# EAGLE design aepro_27C512 (EAGLE 9.4.2)
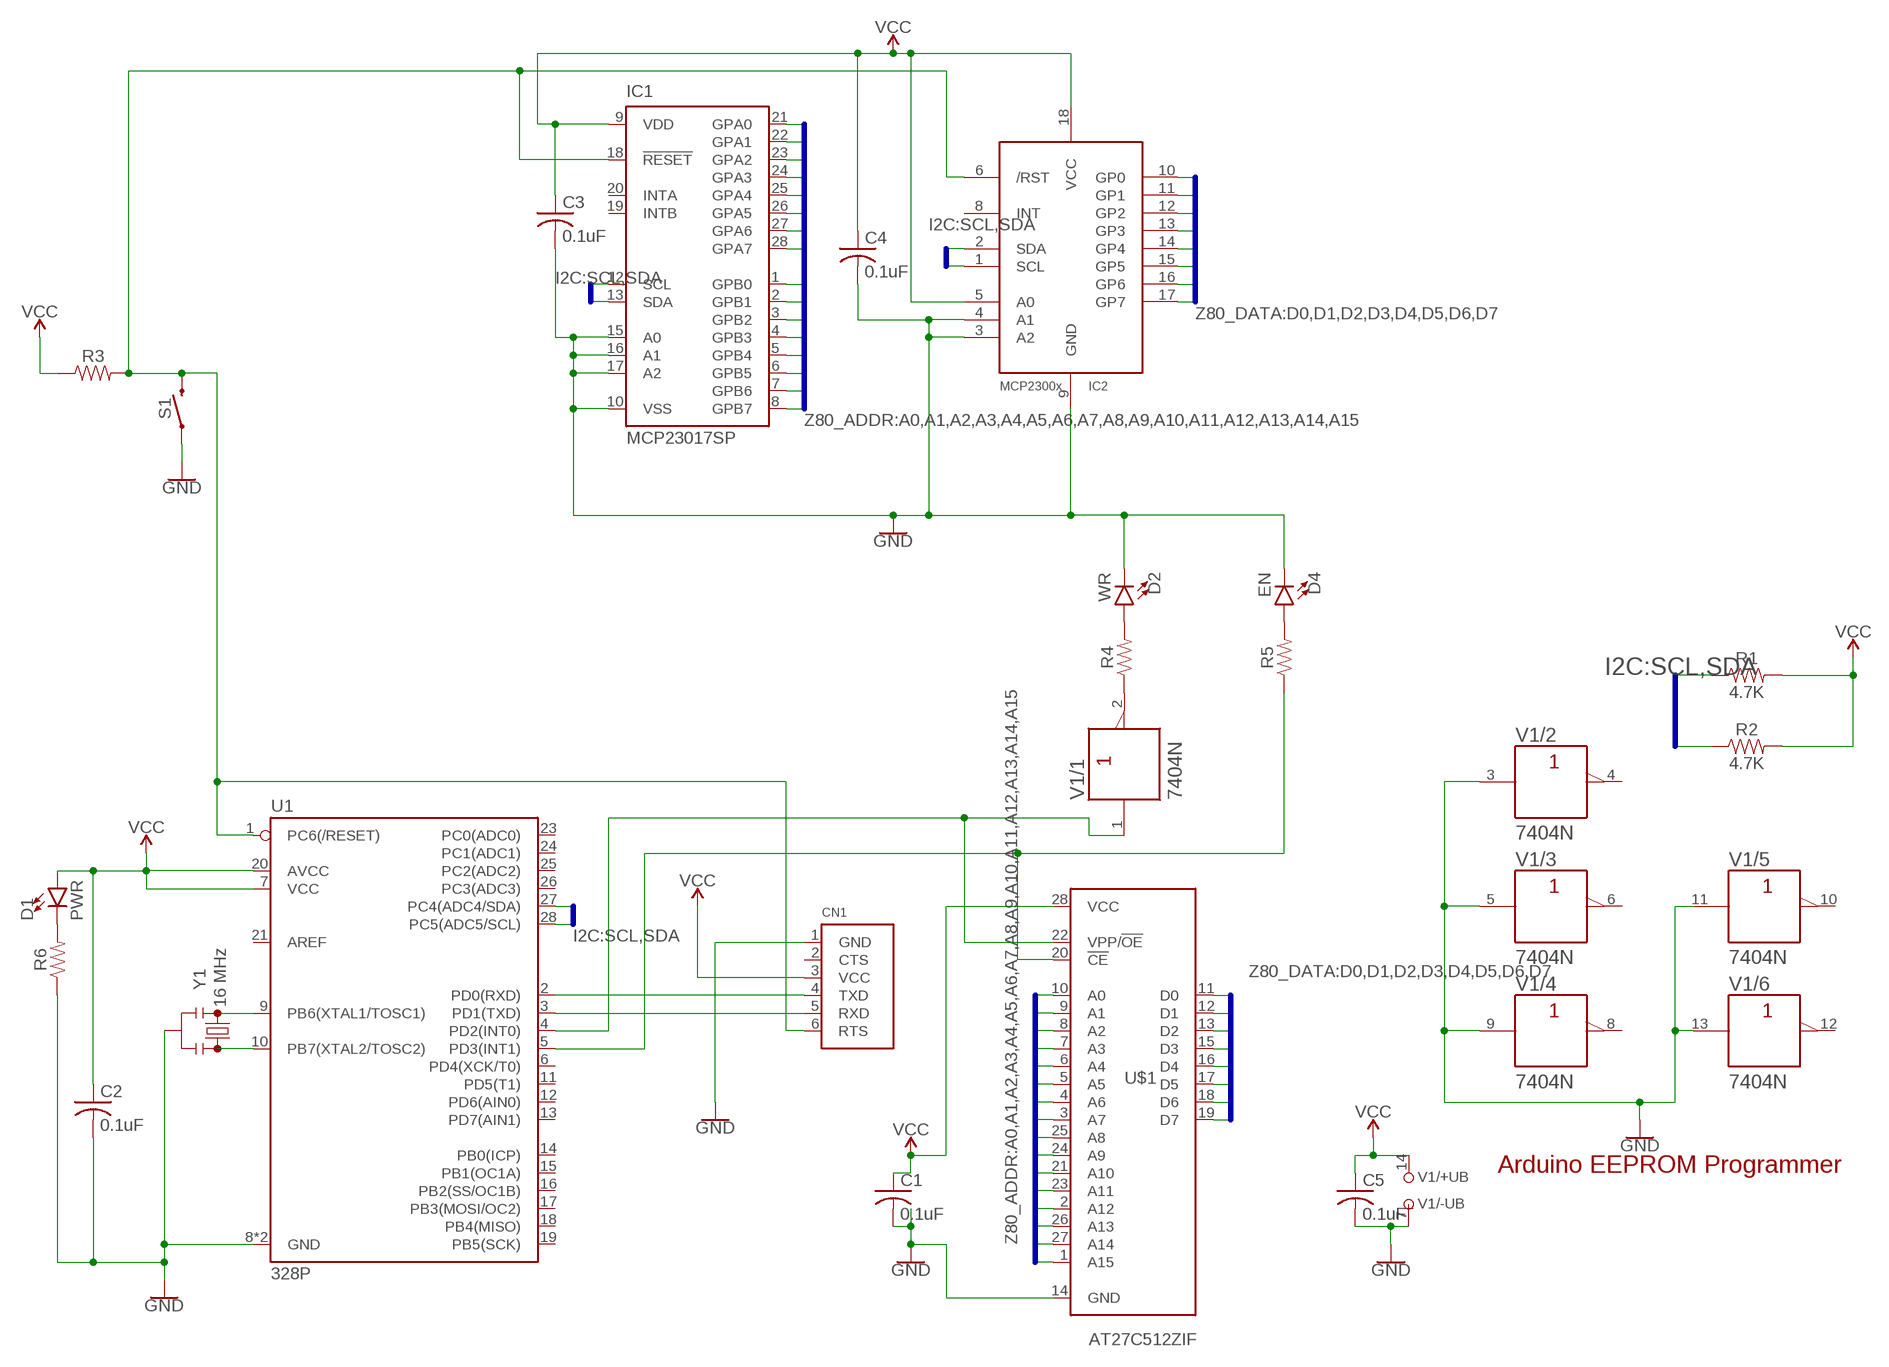
[diagram p0: schematic, sheet 1]

## Parts
C1  0.1uF  C-US050-024X044  [C050-024X044]
C2  0.1uF  C-US050-024X044  [C050-024X044]
C3  0.1uF  C-US050-024X044  [C050-024X044]
C4  0.1uF  C-US050-024X044  [C050-024X044]
C5  0.1uF  C-US050-024X044  [C050-024X044]
CN1  FTDIUSBCABLE  [1X06_ROUND]
D1  PWR  LED3MM  [LED_3MM]
D2  WR  LED3MM  [LED_3MM]
D4  EN  LED3MM  [LED_3MM]
IC1  MCP23017SP  [DIL28-3]
IC2  MCP23008/P  [DIL18]
R1  4.7K  RESISTORAXIAL-0.3  [AXIAL-0.3]
R2  4.7K  RESISTORAXIAL-0.3  [AXIAL-0.3]
R3  RESISTORAXIAL-0.3  [AXIAL-0.3]
R4  RESISTORAXIAL-0.3  [AXIAL-0.3]
R5  RESISTORAXIAL-0.3  [AXIAL-0.3]
R6  RESISTORAXIAL-0.3  [AXIAL-0.3]
S1  MOMENTARY-SWITCH-SPST-PTH-6.0MM  [TACTILE_SWITCH_PTH_6.0MM]
U1  328P  ATMEGA328P_PDIP  [DIP28]
U$1  AT27C512ZIF  [DIL28-6-ZIF_SOCKET]
V1  7404N  [DIL14]
Y1  16 MHz  RESONATORPTH-7.6X3.8  [RESONATOR-PTH-7.6X3.8]

## Nets
A0: IC1.21(GPA0) U$1.10(A0)
A1: IC1.22(GPA1) U$1.9(A1)
A2: IC1.23(GPA2) U$1.8(A2)
A3: IC1.24(GPA3) U$1.7(A3)
A4: IC1.25(GPA4) U$1.6(A4)
A5: IC1.26(GPA5) U$1.5(A5)
A6: IC1.27(GPA6) U$1.4(A6)
A7: IC1.28(GPA7) U$1.3(A7)
A8: IC1.1(GPB0) U$1.25(A8)
A9: IC1.2(GPB1) U$1.24(A9)
A10: IC1.3(GPB2) U$1.21(A10)
A11: IC1.4(GPB3) U$1.23(A11)
A12: IC1.5(GPB4) U$1.2(A12)
A13: IC1.6(GPB5) U$1.26(A13)
A14: IC1.7(GPB6) U$1.27(A14)
A15: IC1.8(GPB7) U$1.1(A15)
D0: IC2.10(GP0) U$1.11(D0)
D1: IC2.11(GP1) U$1.12(D1)
D2: IC2.12(GP2) U$1.13(D2)
D3: IC2.13(GP3) U$1.15(D3)
D4: IC2.14(GP4) U$1.16(D4)
D5: IC2.15(GP5) U$1.17(D5)
D6: IC2.16(GP6) U$1.18(D6)
D7: IC2.17(GP7) U$1.19(D7)
GND: C1.2 C2.2 C3.2 C4.2 C5.2 CN1.1(GND) D2.K(C) D4.K(C) IC1.10(VSS) IC1.15(A0) IC1.16(A1) IC1.17(A2) IC2.3(A2) IC2.4(A1) IC2.9(GND) R6.P$1 S1.1 U1.8(GND) U1.22(GND) U$1.14(GND) V1.3(/2:A) V1.5(/3:A) V1.7(/-UB:-UB) V1.9(/4:A) V1.11(/5:A) V1.13(/6:A) Y1.2
N$1: D2.A R4.P$2
N$2: U1.4(PD2(INT0)) U$1.22(VPP/!OE) V1.1(/1:A)
N$4: R5.P$1 U1.5(PD3(INT1)) U$1.20(!CE)
N$6: CN1.4(TXD) U1.2(PD0(RXD))
N$7: CN1.6(RTS) IC1.18(!RESET) IC2.6(/RST) R3.P$2 S1.3 U1.1(PC6(/RESET))
N$8: R4.P$1 V1.2(/1:Y)
N$9: D4.A R5.P$2
N$10: D1.K(C) R6.P$2
N$11: CN1.5(RXD) U1.3(PD1(TXD))
N$13: U1.9(PB6(XTAL1/TOSC1)) Y1.1
N$14: U1.10(PB7(XTAL2/TOSC2)) Y1.3
SCL: IC1.12(SCL) IC2.1(SCL) R1.P$1 U1.28(PC5(ADC5/SCL))
SDA: IC1.13(SDA) IC2.2(SDA) R2.P$1 U1.27(PC4(ADC4/SDA))
VCC: C1.1 C2.1 C3.1 C4.1 C5.1 CN1.3(VCC) D1.A IC1.9(VDD) IC2.5(A0) IC2.18(VCC) R1.P$2 R2.P$2 R3.P$1 U1.7(VCC) U1.20(AVCC) U$1.28(VCC) V1.14(/+UB:+UB)
Unconnected: CN1.2(CTS) IC1.19(INTB) IC1.20(INTA) IC2.8(INT) U1.6(PD4(XCK/T0)) U1.11(PD5(T1)) U1.12(PD6(AIN0)) U1.13(PD7(AIN1)) U1.14(PB0(ICP)) U1.15(PB1(OC1A)) U1.16(PB2(SS/OC1B)) U1.17(PB3(MOSI/OC2)) U1.18(PB4(MISO)) U1.19(PB5(SCK)) U1.21(AREF) U1.23(PC0(ADC0)) U1.24(PC1(ADC1)) U1.25(PC2(ADC2)) U1.26(PC3(ADC3)) V1.4(/2:Y) V1.6(/3:Y) V1.8(/4:Y) V1.10(/5:Y) V1.12(/6:Y)

## Buses
I2C:SCL,SDA
Z80_ADDR:A0,A1,A2,A3,A4,A5,A6,A7,A8,A9,A10,A11,A12,A13,A14,A15
Z80_DATA:D0,D1,D2,D3,D4,D5,D6,D7

## Notes on the sheet
- Arduino EEPROM Programmer

## Library data of the parts
C1-C5 = rcl:C-US: CAPACITOR, American symbol; SPICEPREFIX: C
CN1 = microbuilder:FTDIUSBCABLE: FTDI TTL-232R USB Cable Connector for FTDI's USB->RS232 Cable
D1 D2 D4 = SparkFun-LED:LED: LED (Generic) Standard schematic elements and footprints for 5mm, 3mm, 1206, and 0603 sized LEDs. Generic LEDs with no color specified.; PROD_ID: DIO-08794
IC1 = adafruit:MCP23017: http://ww1.microchip.com/downloads/en/DeviceDoc/21952a.pdf Source: http://ww1.microchip.com/downloads/en/DeviceDoc/21952a.pdf
IC2 = adafruit:MCP23008: MCP23008 Inexpensive i2c i/o expander - 8 general purpose i/o pins with optional pullups
R1-R6 = SparkFun-Resistors:RESISTOR: Generic Resistor Package
S1 = SparkFun-Switches:MOMENTARY-SWITCH-SPST: Momentary Switch (Pushbutton) - SPST Normally-open (NO) SPST momentary switches (buttons, pushbuttons). Variants PTH-12MM - 12mm square, through-hole Momentary Pushbutton Switch - 12mm Square <https://www.sparkfun.com/products/9190> (COM-09190) PTH-6.0MM, PTH-6.0MM-KIT - 6.0mm square, through-hole Mini Pushbutton Switch <https://www.sparkfun.com/products/97> (COM-00097) KIT package intended for soldering kit's - only one side of pads' copper is exposed. PTH-RIGHT-ANGLE-KIT - Right-angle, through-hole Right Angle Tactile Button <https://www.sparkfun.com/products/10791> - Used on SparkFun BigTime Watch Kit <https://www.sparkfun.com/products/11734> SMD-12MM - 12mm square, surface-mount Tactile Button - SMD (12mm) <https://www.sparkfun.com/products/12993> (COM-12993) Used on SparkFun PicoBoard <https://www.sparkfun.com/products/11888> SMD-4.5MM - 4.5mm Square Trackball Switch Used on SparkFun Blackberry Trackballer Breakout <https://www.sparkfun.com/products/13169> SMD-4.6MMX2.8MM - 4.60mm x 2.80mm, surface mount Used on SparkFun SAMD21 Mini Breakout <https://www.sparkfun.com/products/13664> SMD-5.2MM, SMD-5.2-REDUNDANT - 5.2mm square, surface-mount Mini Pushbutton Switch - SMD <https://www.sparkfun.com/products/8720> (COM-08720) Used on Arduino Pro Mini <https://www.sparkfun.com/products/11114> REDUNDANT package connects both switch circuits together SMD-6.0X3.5MM - 6.0 x 3.5mm, surface mount Momentary Reset Switch SMD <https://www.sparkfun.com/products/8229> (COM-08229) SMD-6.2MM-TALL - 6.2mm square, surface mount Tactile Button - SMD (6mm) <https://www.sparkfun.com/products/12992> Used on SparkFun Digital Sandbox <https://www.sparkfun.com/products/12651> SMD-RIGHT-ANGLE - Right-angle, surface mount Used on SparkFun Block for Intel® Edison - Arduino <https://www.sparkfun.com/products/13036>; PROD_ID: SWCH-08441; SF_SKU: COM-00097
U1 = SparkFun-IC-Microcontroller:ATMEGA328P_PDIP: Atmel 328P Through hole ATMEGA328P uC used in the Arduino 32kb flash, 1k EEPROM, 2k SRAM Datasheet <http://www.sparkfun.com/datasheets/Components/SMD/ATMega328.pdf> SparkFun Products Storefront component: AVR 28 Pin 20MHz 32K 6A/D - ATMega328P <https://www.sparkfun.com/products/9061> (COM-09061) SparkFun Simon Says - Through-Hole Soldering Kit <https://www.sparkfun.com/products/10547> (KIT-10547) SparkFun Learn to Solder - Simon Says <https://www.sparkfun.com/products/13708> (KIT-13708) SparkFun BigTime Watch Kit <https://www.sparkfun.com/products/11734> (KIT-11734) SparkFun ClockIt <https://www.sparkfun.com/products/10930> (KIT-10930) SparkFun Serial Enabled LCD Kit <https://www.sparkfun.com/products/10097> (LCD-10097) SparkFun Simon Tilts - Through Hole Soldering Kit <https://www.sparkfun.com/products/12634> (KIT-12634) SparkFun Frequency Counter Kit <https://www.sparkfun.com/products/10140> (KIT-10140) FabFM Radio Kit <https://www.sparkfun.com/products/11043> (KIT-11043) SparkFun Binary Blaster Kit <https://www.sparkfun.com/products/12037> (KIT-12037) SparkFun Metro-Gnome <https://www.sparkfun.com/products/9236> (KIT-09236) ATmega328 with Arduino Optiboot (Uno) <https://www.sparkfun.com/products/10524> (DEV-10524); PROD_ID: IC-09136
U$1 = wntrmute:AT27C512
V1 = 74ttl-din:74*04: Hex INVERTER
Y1 = SparkFun-Clocks:RESONATOR: Resonators (Generic) Ceramic resonators are clock-generating components, often used to control timing in microcontrollers. They usually have 3 pins: two pins for oscillation, and one pin for ground. Compared to crystals, resonators have worse tolerance, but are usually much cheaper. Plus, they have built-in load capacitors! These devices are used on boards like the Arduino Pro 8MHz <https://www.sparkfun.com/products/11114> and Arduino Pro 16MHz <https://www.sparkfun.com/products/11113>.

## Net classes
0 default: width 0.152 mm, drill 0.254 mm, clearance 0.152 mm

## Board
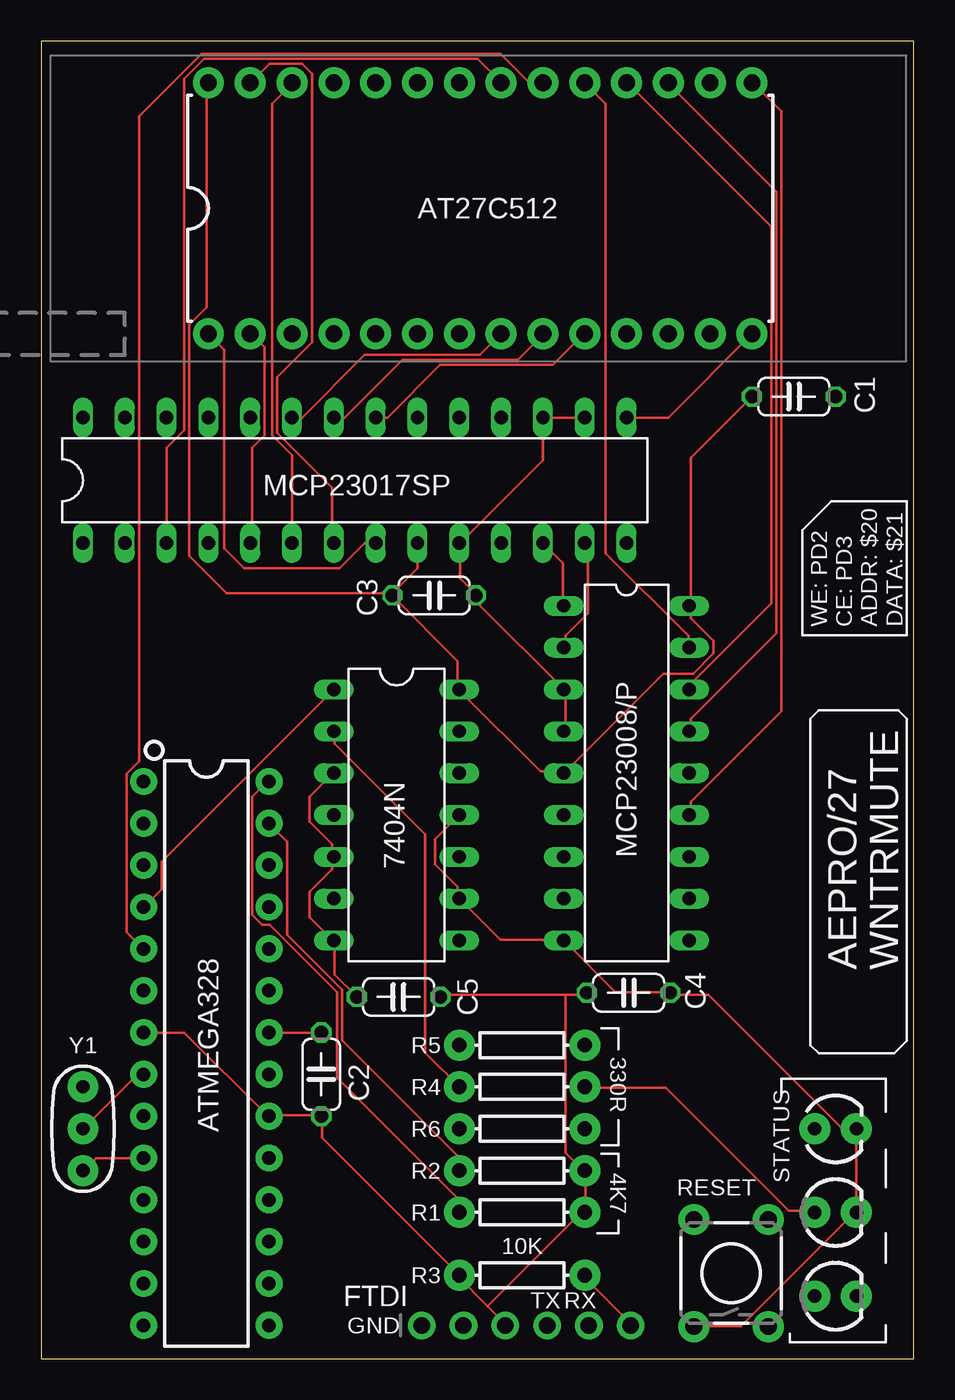
[diagram p1: board, top side]
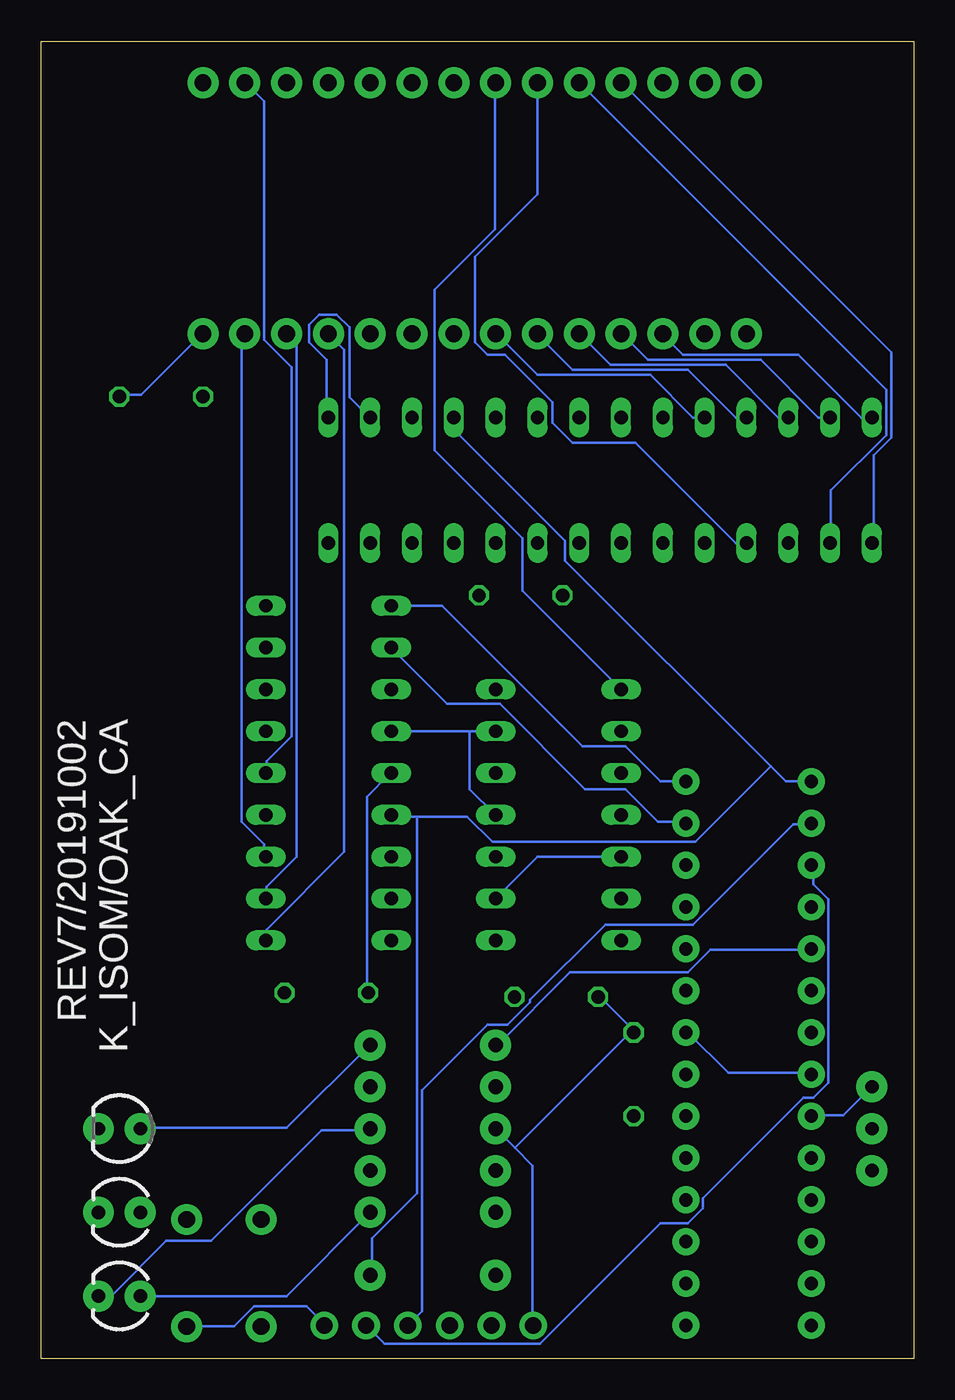
[diagram p2: board, bottom side, seen from below]

Size 53.01 x 80 mm. Coordinates in mm from the lower left corner, seen from the top.
Outline: 0,0 53.01,0 53.01,80 0,80 0,0
Copper layers (1*16): Top 0.035559375mm / dielectric 1.6mm / Bottom 0.035559375mm
Design rules "oshpark-2layer": minimum track width 6mil, minimum drill 10mil, track to track 6mil, track to pad 6mil, pad to pad 6mil, via to via 6mil, smd to smd 6mil, copper to edge 15mil, drill to drill 6mil, minimum pad ring 5mil, minimum via ring 5mil, stop-mask expansion 2.5mil, vias tented up to drill 0mil, thermal gap 10mil

### Footprints (pad centres in the part's own frame; a part is rotated, then mirrored left to right if it is on the bottom)
C050-024X044 = drill 0.813 octagon: 1 -2.54,0; 2 2.54,0
1X06_ROUND = drill 1 pad 1.676: 1 -6.35,0; 2 -3.81,0; 3 -1.27,0; 4 1.27,0; 5 3.81,0; 6 6.35,0
LED_3MM = drill 0.813 pad 1.88: A -1.27,0; K 1.27,0
DIL28-3 = drill 0.813 long: 1 -16.51,-3.81; 2 -13.97,-3.81; 3 -11.43,-3.81; 4 -8.89,-3.81; 5 -6.35,-3.81; 6 -3.81,-3.81; 7 -1.27,-3.81; 8 1.27,-3.81; 9 3.81,-3.81; 10 6.35,-3.81; 11 8.89,-3.81; 12 11.43,-3.81; 13 13.97,-3.81; 14 16.51,-3.81; 15 16.51,3.81; 16 13.97,3.81; 17 11.43,3.81; 18 8.89,3.81; 19 6.35,3.81; 20 3.81,3.81; 21 1.27,3.81; 22 -1.27,3.81; 23 -3.81,3.81; 24 -6.35,3.81; 25 -8.89,3.81; 26 -11.43,3.81; 27 -13.97,3.81; 28 -16.51,3.81
DIL18 = drill 0.813 long: 1 -10.16,-3.81; 2 -7.62,-3.81; 3 -5.08,-3.81; 4 -2.54,-3.81; 5 0,-3.81; 6 2.54,-3.81; 7 5.08,-3.81; 8 7.62,-3.81; 9 10.16,-3.81; 10 10.16,3.81; 11 7.62,3.81; 12 5.08,3.81; 13 2.54,3.81; 14 0,3.81; 15 -2.54,3.81; 16 -5.08,3.81; 17 -7.62,3.81; 18 -10.16,3.81
AXIAL-0.3 = drill 0.9 pad 1.88: P$1 -3.81,0; P$2 3.81,0
TACTILE_SWITCH_PTH_6.0MM = drill 1.016 pad 1.88: 1 -3.251,2.261; 2 3.251,2.261; 3 -3.251,-2.261; 4 3.251,-2.261
DIP28 = drill 0.813 pad 1.626: 1 -16.51,-3.81; 2 -13.97,-3.81; 3 -11.43,-3.81; 4 -8.89,-3.81; 5 -6.35,-3.81; 6 -3.81,-3.81; 7 -1.27,-3.81; 8 1.27,-3.81; 9 3.81,-3.81; 10 6.35,-3.81; 11 8.89,-3.81; 12 11.43,-3.81; 13 13.97,-3.81; 14 16.51,-3.81; 15 16.51,3.81; 16 13.97,3.81; 17 11.43,3.81; 18 8.89,3.81; 19 6.35,3.81; 20 3.81,3.81; 21 1.27,3.81; 22 -1.27,3.81; 23 -3.81,3.81; 24 -6.35,3.81; 25 -8.89,3.81; 26 -11.43,3.81; 27 -13.97,3.81; 28 -16.51,3.81
DIL28-6-ZIF_SOCKET = drill 1.016 pad 1.88: 1 -16.51,-7.62; 2 -13.97,-7.62; 3 -11.43,-7.62; 4 -8.89,-7.62; 5 -6.35,-7.62; 6 -3.81,-7.62; 7 -1.27,-7.62; 8 1.27,-7.62; 9 3.81,-7.62; 10 6.35,-7.62; 11 8.89,-7.62; 12 11.43,-7.62; 13 13.97,-7.62; 14 16.51,-7.62; 15 16.51,7.62; 16 13.97,7.62; 17 11.43,7.62; 18 8.89,7.62; 19 6.35,7.62; 20 3.81,7.62; 21 1.27,7.62; 22 -1.27,7.62; 23 -3.81,7.62; 24 -6.35,7.62; 25 -8.89,7.62; 26 -11.43,7.62; 27 -13.97,7.62; 28 -16.51,7.62
DIL14 = drill 0.813 long: 1 -7.62,-3.81; 2 -5.08,-3.81; 3 -2.54,-3.81; 4 0,-3.81; 5 2.54,-3.81; 6 5.08,-3.81; 7 7.62,-3.81; 8 7.62,3.81; 9 5.08,3.81; 10 2.54,3.81; 11 0,3.81; 12 -2.54,3.81; 13 -5.08,3.81; 14 -7.62,3.81
RESONATOR-PTH-7.6X3.8 = drill 0.8 pad 1.88: 1 -2.54,0; 2 0,0; 3 2.54,0

### Placement (x,y rotation side)
C1  45.72,58.42 0 top
C2  17.02,17.27 90 top
C3  23.88,46.35 0 top
C4  35.69,22.23 0 top
C5  21.72,21.97 180 top
CN1  29.46,2.03 0 top
D1  48.26,3.81 0 top
D2  48.26,8.89 0 top
D4  48.26,13.97 180 bottom
IC1  19.05,53.34 0 top
IC2  35.56,35.56 270 top
R1  29.21,8.89 0 top
R2  29.21,11.43 0 top
R3  29.21,5.08 0 top
R4  29.21,16.51 0 top
R5  29.21,19.05 0 top
R6  29.21,13.97 0 top
S1  41.91,5.21 90 top
U1  10.03,18.54 270 top
U$1  26.67,69.85 0 top
V1  21.59,33.02 270 top
Y1  2.54,13.97 270 top

### Tracks (layer width: path | path; a pad name or v marks a point on that pad's centre or on a via)
A0
  Top 0.152: IC1.21 21.03,57.15 24.23,60.35 31.09,60.35 32.92,62.18 U$1.10
A1
  Top 0.152: IC1.22 18.44,57.15 21.95,60.66 28.96,60.66 30.48,62.18 U$1.9
A2
  Top 0.152: IC1.23 15.85,57.15 19.66,60.96 26.67,60.96 U$1.8
A3
  Bottom 0.152: IC1.24 13.41,57.15 16,59.74 22.86,59.74 25.3,62.18 U$1.7
A4
  Bottom 0.152: IC1.25 10.82,57.15 13.72,60.05 20.73,60.05 22.86,62.18 U$1.6
A5
  Bottom 0.152: IC1.26 8.23,57.15 11.43,60.35 18.44,60.35 U$1.5
A6
  Bottom 0.152: IC1.27 5.79,57.15 9.3,60.66 16.15,60.66 17.68,62.18 U$1.4
A7
  Bottom 0.152: IC1.28 3.2,57.15 7.01,60.96 14.02,60.96 15.24,62.18 U$1.3
A8
  Bottom 0.152: IC1.1 2.44,49.53 2.44,54.86 1.37,55.93 1.37,61.11 17.68,77.42 U$1.25
A9
  Bottom 0.152: U$1.24 1.68,58.83 1.68,56.08 5.03,52.73 5.03,49.53 IC1.2
A10
  Top 0.152: IC1.3 7.62,55.32 8.69,56.39 8.69,77.72 9.91,78.94 26.52,78.94 27.89,77.57 U$1.21
A11
  Bottom 0.152: IC1.4 10.82,49.53 16.92,55.63 20.73,55.63 21.95,56.84 21.95,58.06 24.84,60.96 25.91,60.96 26.67,61.72 26.67,66.9 22.86,70.71 U$1.23
A12
  Top 0.152: IC1.5 12.8,49.53 12.8,55.32 13.56,56.08 13.56,61.42 12.8,62.18 U$1.2
A13
  Top 0.152: IC1.6 15.24,54.86 14.02,56.08 14.02,76.2 15.24,77.42 U$1.26
A14
  Top 0.152: U$1.27 13.87,78.64 15.85,78.64 16.46,78.03 16.46,61.72 14.33,59.59 14.33,56.24 17.68,52.88 17.68,49.53 IC1.7
A15
  Top 0.152: IC1.8 19.66,49.53 18.14,48.01 12.34,48.01 11.12,49.23 11.12,61.27 U$1.1
D0
  Bottom 0.152: U$1.11 34.59,61.27 34.59,30.79 39.32,26.06 39.32,25.45 IC2.10
D1
  Bottom 0.152: IC2.11 39.32,28.04 39.32,28.65 37.49,30.48 37.49,61.57 38.1,62.18 U$1.12
D2
  Bottom 0.152: U$1.13 40.84,62.03 40.84,32.61 39.47,31.24 39.47,30.48 IC2.12
D3
  Top 0.152: IC2.13 39.47,33.07 39.47,33.83 44.96,39.32 44.96,75.74 43.28,77.42 U$1.15
D4
  Bottom 0.152: IC2.14 39.32,35.66 39.32,36.27 37.8,37.8 37.8,60.2 39.47,61.87 39.47,76.35 40.54,77.42 U$1.16
D5
  Top 0.152: IC2.15 39.47,38.1 39.47,38.86 44.65,44.04 44.65,70.87 38.1,77.42 U$1.17
D6
  Top 0.152: IC2.16 39.47,40.69 39.47,41 44.35,45.87 44.35,68.73 35.66,77.42 U$1.18
D7
  Top 0.152: U$1.19 34.29,76.2 34.29,48.92 39.32,43.89 39.32,43.28 IC2.17
GND
  Top 0.152: Y1.2 5.79,17.22 6.1,17.22 U1.8 | 17.68,30.48 17.68,31.24 16.31,32.61 16.31,34.14 17.68,35.51 V1.3 | U1.22 C2.2 | C5.2 17.83,23.32 17.83,25.3 V1.7 17.68,25.45 16.31,26.82 16.31,28.35 17.68,29.72 17.68,30.48 | 17.68,30.48 V1.5 | 49.53,8.99 42.52,1.98 39.78,1.98 S1.1 | 49.53,8.99 D4.K 49.53,14.02 48.62,14.02 40.54,22.1 38.25,22.1 C4.2 38.1,22.25 34.9,22.25 IC2.9 31.7,25.45 27.89,25.45 V1.9 25.3,28.04 25.3,28.65 23.93,30.02 23.93,31.55 V1.11 | 49.53,8.99 D2.K | IC1.15 38.1,57.15 U$1.14 | IC1.16 IC1.17 30.48,54.56 25.45,49.53 | 25.45,49.53 25.45,47.4 26.36,46.48 C3.2 26.52,46.33 26.52,45.87 IC2.3 31.85,40.54 31.85,38.1 IC2.4 | 25.45,49.53 IC1.10
  Bottom 0.152: R6.P$1 24.23,12.8 | 24.23,12.8 23.16,11.73 23.16,2.13 CN1.1 | 17.07,19.96 16.92,19.81 C2.2 17.07,19.96 | 17.07,19.96 19.05,21.95 C5.2 | U1.8 6.25,17.37 11.28,17.37 13.72,19.81 U1.22 | 17.07,19.96 24.23,12.8 | C1.2 48.16,58.52 46.94,58.52 43.28,62.18 U$1.14 | IC2.4 26.98,38.1 | 26.98,38.1 V1.13 | 26.98,38.1 26.98,34.59 V1.11 | IC1.15 35.66,57.15 35.66,60.66 36.73,61.72 36.73,62.79 36.12,63.4 35.05,63.4 34.29,62.64 34.29,58.37 33.07,57.15 IC1.16 | V1.5 22.86,30.48 V1.9
N$1
  Top 0.152: D2.A 46.94,8.99 45.41,8.99 37.95,16.46 33.07,16.46 R4.P$2
N$2
  Top 0.152: V1.1 7.32,30.18 7.32,28.5 6.25,27.43 U1.4
  Bottom 0.152: V1.1 23.77,46.63 23.77,49.84 29.11,55.17 29.11,64.92 25.45,68.58 25.45,77.42 U$1.22
N$4
  Top 0.152: U$1.20 30.48,77.57 29.57,77.57 27.89,79.25 9.75,79.25 5.94,75.44 5.94,36.27 5.18,35.51 5.18,25.91 6.1,24.99 U1.5
  Bottom 0.152: U1.5 6.25,24.84 12.34,24.84 13.72,23.47 20.88,23.47 25.3,19.05 R5.P$1
N$6
  Bottom 0.152: CN1.4 29.87,2.9 29.87,16.31 25.91,20.27 24.69,20.27 23.32,21.64 23.32,21.79 18.75,26.36 13.41,26.36 7.32,32.46 6.25,32.46 U1.2
N$7
  Top 0.152: CN1.6 35.81,2.13 32.92,5.03 R3.P$2
  Bottom 0.152: S1.3 44.04,1.98 41.3,1.98 40.08,3.2 36.88,3.2 35.81,2.13 CN1.6 | 8.69,35.97 7.77,35.05 U1.1 | 8.69,35.97 21.18,48.46 21.18,49.68 27.89,56.39 27.89,57.15 IC1.18 | 30.18,32.92 27.13,32.92 25.6,31.39 13.26,31.39 8.69,35.97 | 30.18,32.92 31.7,32.92 IC2.6 | 30.18,32.92 30.18,10.06 32.92,7.32 32.92,5.18 R3.P$2
N$8
  Top 0.152: R4.P$1 23.32,18.59 23.32,31.85 17.83,37.34 17.83,38.1 V1.2
N$9
  Bottom 0.152: D4.A 46.94,14.02 38.1,14.02 33.07,19.05 R5.P$2
N$10
  Bottom 0.152: D1.K 48.77,3.81 45.41,7.16 42.67,7.16 35.97,13.87 33.07,13.87 R6.P$2
N$11
  Bottom 0.152: CN1.5 32.16,0.91 22.71,0.91 15.39,8.23 13.72,8.23 12.8,9.14 12.8,9.75 6.71,15.85 6.1,15.85 5.18,16.76 5.18,27.89 6.1,28.8 6.1,29.87 U1.3
N$13
  Bottom 0.152: Y1.1 4.27,14.78 6.1,14.78 U1.9
N$14
  Top 0.152: U1.10 3.35,12.19 2.59,11.43 Y1.3
SCL
  Top 0.152: IC1.12 31.7,48.31 31.7,45.72 IC2.1 | R1.P$1 25.3,8.99 25.3,9.75 17.98,17.07 17.98,22.25 13.87,26.36 13.41,26.36 12.8,26.98 12.8,34.14 13.72,35.05 U1.28
  Bottom 0.152: U1.28 15.39,35.05 17.53,37.19 20.12,37.19 28.65,45.72 IC2.1
SDA
  Top 0.152: IC2.2 31.85,43.28 31.85,43.89 33.22,45.26 33.22,49.38 33.07,49.53 IC1.13 | R2.P$1 25.3,11.43 25.3,12.34 18.29,19.36 18.29,22.4 14.94,25.76 14.94,31.39 13.87,32.46 U1.27
  Bottom 0.152: IC2.2 28.35,39.78 25.15,39.78 19.96,34.59 17.53,34.59 15.54,32.61 13.87,32.61 U1.27
VCC
  Top 0.152: U1.7 8.69,19.81 13.72,14.78 U1.20 13.87,14.78 16.92,14.78 C2.1 17.07,14.63 17.07,13.41 R3.P$1 25.3,5.03 27.13,3.2 | 27.13,3.2 28.19,2.13 CN1.3 | 31.85,22.1 33.07,22.1 C4.1 | 31.85,22.1 24.38,22.1 C5.1 | 31.85,22.1 31.85,12.5 32.92,11.43 R2.P$2 33.07,11.43 33.07,8.99 R1.P$2 32.92,8.99 27.13,3.2 | 39.47,45.72 39.47,54.71 C1.1 | IC1.9 22.86,48.01 21.34,46.48 | 21.34,46.48 11.28,46.48 8.99,48.77 8.99,62.79 10.06,63.86 10.06,77.42 U$1.28 | 21.34,46.48 C3.1 21.34,46.33 25.3,42.37 25.3,40.69 V1.14 25.45,40.54 30.33,35.66 31.7,35.66 IC2.5 37.8,41.6 39.62,41.6 40.84,42.82 40.84,43.59 39.47,44.96 39.47,45.72 | 39.47,45.72 IC2.18
  Bottom 0.152: D1.A 38.1,3.81 R1.P$2 | C4.1 33.22,22.25 33.22,34.14 31.85,35.51 IC2.5

### Text on the board
tPlace: AT27C512 | WE: PD2 / CE: PD3 / ADDR: $20 / DATA: $21 | AEPRO/27 | WNTRMUTE | Y1 | ATMEGA328 | 330R | STATUS | 4K7 | RESET | 10K | FTDI | TX | RX | GND
bPlace: K_ISOM/OAK_CA | REV7/20191002